# EAGLE design Air858 (EAGLE 7.7.0)
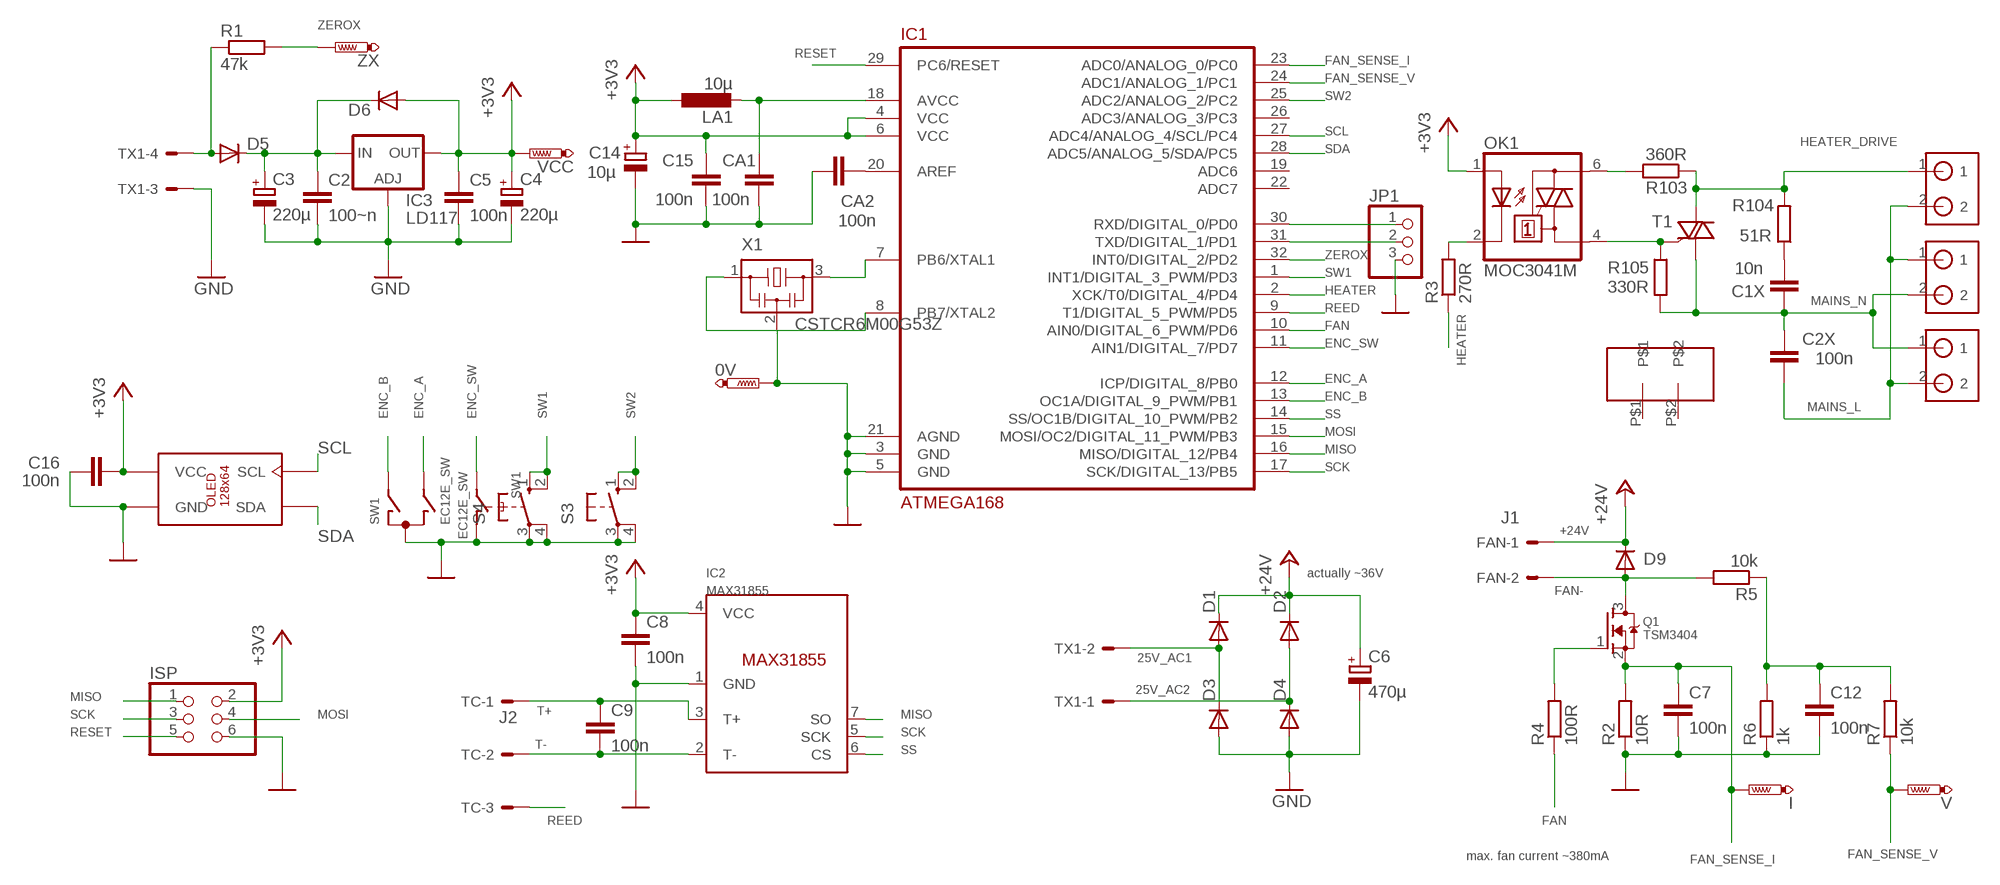
[diagram p0: schematic, sheet 1]

## Parts
0V  PTR1B1,27  [B1,27]
C1X  10n  C-EU075-032X103  [C075-032X103]
C2  100~n  C-EUC0603  [C0603]
C2X  100n  C-EU150-054X183  [C150-054X183]
C3  220µ  CPOL-EUSMCE  [SMC_E]
C4  220µ  CPOL-EUSMCE  [SMC_E]
C5  100n  C-EUC0603  [C0603]
C6  470µ  CPOL-EUE5-10.5  [E5-10,5]
C7  100n  C-EUC0603K  [C0603K]
C8  100n  C-EUC0603K  [C0603K]
C9  100n  C-EUC0603K  [C0603K]
C12  100n  C-EUC0603K  [C0603K]
C14  10µ  CPOL-EUB/3528-21W  [B/3528-21W]
C15  100n  C-EUC0603K  [C0603K]
C16  100n  C-EUC0603K  [C0603K]
CA1  100n  C-EUC0603K  [C0603K]
CA2  100n  C-EUC0603K  [C0603K]
D1  DIODE-DO-214AC  [DO-214AC]
D2  DIODE-DO-214AC  [DO-214AC]
D3  DIODE-DO-214AC  [DO-214AC]
D4  DIODE-DO-214AC  [DO-214AC]
D5  DIODE-DO-214AC  [DO-214AC]
D6  DIODE-DO-214AC  [DO-214AC]
D9  DIODE-DO-214AC  [DO-214AC]
FAN  J1  22-23-2021  [22-23-2021]
HEATER  2POL5MM  [2POL5MM]
I  PTR1B1,27  [B1,27]
IC1  ATMEGA168  AVR-ATMEGA168-TQP32  [QFP32]
IC2  MAX31855  [SOIC8]
IC3  LD117  LD117AS12TR  [SOT223]
ISP  PINHD-2X3  [2X03]
JP1  PINHD-1X3  [1X03]
LA1  10µ  L-EUL3225P  [L3225P]
MAINS1  2POL5MM  [2POL5MM]
MAINS2  2POL5MM  [2POL5MM]
OK1  MOC3041M  [DIL06]
OLED1  SSD1306-IIC  [SSD1306-IIC]
Q1  TSM3404  MOSFET-NREFLOW  [SOT23]
R1  47k  R-EU_R0603  [R0603]
R2  10R  R-EU_M1206  [M1206]
R3  270R  R-EU_R0603  [R0603]
R4  100R  R-EU_R0603  [R0603]
R5  10k  R-EU_R0603  [R0603]
R6  1k  R-EU_R0603  [R0603]
R7  10k  R-EU_R0603  [R0603]
R103  360R  R-EU_M1206  [M1206]
R104  51R  R-EU_0309/10  [0309/10]
R105  330R  R-EU_M1206  [M1206]
S3  40-XX  [B3F-40XX]
S4  40-XX  [B3F-40XX]
SW1  EC12E_SW  [ALPS_EC12E_SW]
T1  BTA16  TIC206D  [TO220BV]
TC  J2  22-23-2031  [22-23-2031]
TX1  J4  22-23-2041  [22-23-2041]
U$5  HEATSINK17X7.5TO220  [HEATSINK17X7.5TO220]
V  PTR1B1,27  [B1,27]
VCC  PTR1B1,27  [B1,27]
X1  CSTCR6M00G53Z  [CSTCR6M]
ZX  PTR1B1,27  [B1,27]

## Nets
10V_AC1: D5.A R1.1 TX1.4
25V_AC1: D1.A D3.C TX1.2
25V_AC2: D2.A D4.C TX1.1
+3V3: C4.+ C5.1 C8.1 C14.+ C15.1 C16.2 D6.A IC1.4(VCC) IC1.6(VCC) IC2.4(VCC) IC3.4(OUT) ISP.2 LA1.1 OK1.1(A) OLED1.VCC VCC.TP
+24V: C6.+ D1.C D2.C D9.C FAN.1
AREF: CA2.2 IC1.20(AREF)
AVCC: CA1.1 IC1.18(AVCC) LA1.2
ENC_A: IC1.12(ICP/DIGITAL_8/PB0) SW1.B
ENC_B: IC1.13(OC1A/DIGITAL_9_PWM/PB1) SW1.A
ENC_SW: IC1.11(AIN1/DIGITAL_7/PD7) SW1.E
FAN: IC1.10(AIN0/DIGITAL_6_PWM/PD6) R4.1
FAN-: D9.A FAN.2 Q1.3(D) R5.2
FAN_SENSE_I: C7.1 I.TP IC1.23(ADC0/ANALOG_0/PC0) Q1.2(S) R2.2
FAN_SENSE_V: IC1.24(ADC1/ANALOG_1/PC1) R7.1 V.TP
GND: 0V.TP C2.2 C3.- C4.- C5.2 C6.- C7.2 C8.2 C12.2 C14.- C15.2 C16.1 CA1.2 CA2.1 D3.A D4.A IC1.3(GND) IC1.5(GND) IC1.21(AGND) IC2.1(GND) IC3.1(ADJ) ISP.6 JP1.3 OLED1.GND R2.1 R6.1 S3.3(P) S3.4(P1) S4.3(P) S4.4(P1) SW1.C SW1.D TX1.3 X1.2
HEATER: IC1.2(XCK/T0/DIGITAL_4/PD4) R3.1
HEATER_DRIVE: HEATER.1 R103.1 R104.2 T1.T2(A2)
MAINS_L: C2X.1 HEATER.2 MAINS1.1 MAINS2.2
MAINS_N: C1X.1 C2X.2 MAINS1.2 MAINS2.1 R105.2 T1.T1(A1)
MISO: IC1.16(MISO/DIGITAL_12/PB4) IC2.7(SO) ISP.1
MOSI: IC1.15(MOSI/OC2/DIGITAL_11_PWM/PB3) ISP.4
N$1: C12.1 R5.1 R6.2 R7.2
N$3: OK1.6(A2) R103.2
N$4: C2.1 C3.+ D5.C D6.C IC3.3(IN)
N$5: OK1.2(C) R3.2
N$8: OK1.4(A1) R105.1 T1.G
N$9: C1X.2 R104.1
N$10: IC1.7(PB6/XTAL1) X1.3
N$11: Q1.1(G) R4.2
N$12: IC1.8(PB7/XTAL2) X1.1
REED: IC1.9(T1/DIGITAL_5_PWM/PD5) TC.3
RESET: IC1.29(PC6/RESET) ISP.5
RXD: IC1.30(RXD/DIGITAL_0/PD0) JP1.1
SCK: IC1.17(SCK/DIGITAL_13/PB5) IC2.5(SCK) ISP.3
SCL: IC1.27(ADC4/ANALOG_4/SCL/PC4) OLED1.SCL
SDA: IC1.28(ADC5/ANALOG_5/SDA/PC5) OLED1.SDA
SS: IC1.14(SS/OC1B/DIGITAL_10_PWM/PB2) IC2.6(CS)
SW1: IC1.1(INT1/DIGITAL_3_PWM/PD3) S4.1(S) S4.2(S1)
SW2: IC1.25(ADC2/ANALOG_2/PC2) S3.1(S) S3.2(S1)
T+: C9.1 IC2.3(T+) TC.1
T-: C9.2 IC2.2(T-) TC.2
TXD: IC1.31(TXD/DIGITAL_1/PD1) JP1.2
ZEROX: IC1.32(INT0/DIGITAL_2/PD2) R1.2 ZX.TP
Unconnected: IC1.19(ADC6) IC1.22(ADC7) IC1.26(ADC3/ANALOG_3/PC3) SW1.GND1(G) SW1.GND2(G) U$5.P$1 U$5.P$2

## Notes on the sheet
- actually ~36V
- max. fan current ~380mA

## Library data of the parts
0V I V VCC ZX = testpad:PTR1: TEST PIN
C1X C2 C2X C5 C7-C9 C12 C15 C16 CA1 CA2 = rcl:C-EU: CAPACITOR, European symbol
C3 C4 C6 C14 = rcl:CPOL-EU: POLARIZED CAPACITOR, European symbol
D1-D6 D9 = diode:DIODE-: DIODE
FAN = con-molex:22-23-2021: .100" (2.54mm) Center Header - 2 Pin; MF: MOLEX; MPN: 22-23-2021; OC_FARNELL: 1462926; OC_NEWARK: 25C3832
HEATER MAINS1 MAINS2 = pit:2POL5MM
IC1 = tidyeagle:AVR-ATMEGA168-TQP32: Atmel 8-bit Microcontroller in TQFP32 package. Datasheet: Summary <http://www.atmel.com/dyn/resources/prod_documents/8271S.pdf>, Full <http://www.atmel.com/dyn/resources/prod_documents/doc8271.pdf> Application Notes: AVR042 - Hardware Design Considerations <http://atmel.com/dyn/resources/prod_documents/doc2521.pdf> Supports the following chips - ATmega48PA ATmega88PA ATmega168PA ATmega328P With Arduino pin labelling.
IC2 = AlexW-Eagle-Libraries:MAX31855
IC3 = v-reg:LD117A?*: Low drop fixed and adjustable positive voltage regulators 1 A Source: http://www.st.com/stonline/products/literature/ds/7194/ld1117axx.pdf
ISP = pinhead:PINHD-2X3: PIN HEADER
JP1 = adafruit:PINHD-1X3: PIN HEADER
LA1 = rcl:L-EU: INDUCTOR, European symbol
OK1 = optocoupler:MOC30*: 6-Pin DIP Zero-Cross Optoisolators Triac Driver Output (250/400 Volt Peak) Source: Data sheet <http://www.fairchildsemi.com/ds/MO/MOC3031M.pdf> The old path of data sheet not more available 2013-05-06.; MF: FAIRCHILD SEMICONDUCTOR; MPN: MOC3041M; OC_FARNELL: 1086677; OC_NEWARK: 78K6090
OLED1 = pit:SSD1306-IIC
Q1 = adafruit:MOSFET-N: N-Channel Mosfet 2N7002E - 60V 260mA SOT23 [Digikey: 2N7002ET1GOSTR-ND] - REEL BSH103 - 30V 850mA SOT23 [Digikey: 568-5013-1-ND]
R1-R7 R103-R105 = rcl:R-EU_: RESISTOR, European symbol
S3 S4 = switch-omron:40-XX: OMRON SWITCH; MF: OMRON COMPONENTS USA; MPN: B3F-4000; OC_FARNELL: 176434; OC_NEWARK: 36K3105
SW1 = switch-alps:EC12E_SW: ALPS rotary Encoder EC12E series with switch; MPN: EC12E2424407; OC_FARNELL: 1520813; OC_NEWARK: 74M1068
T1 = triac:TIC206: TRIAC Source: http://www.bourns.com/pdfs/tic206.pdf
TC = con-molex:22-23-2031: .100" (2.54mm) Center Header - 3 Pin; MF: MOLEX; MPN: 22-23-2031; OC_FARNELL: 1462950; OC_NEWARK: 30C0862
TX1 = con-molex:22-23-2041: .100" (2.54mm) Center Header - 4 Pin; MF: MOLEX; MPN: 22-23-2041; OC_FARNELL: 1462920; OC_NEWARK: 38C0355
U$5 = pit:HEATSINK17X7.5TO220
X1 = murata-filter:CSTCR: Resonator Source: murata.co.jp; MPN: CSTCR6M00G53-R0; OC_FARNELL: 1170434; OC_NEWARK: 25M8759

## Board
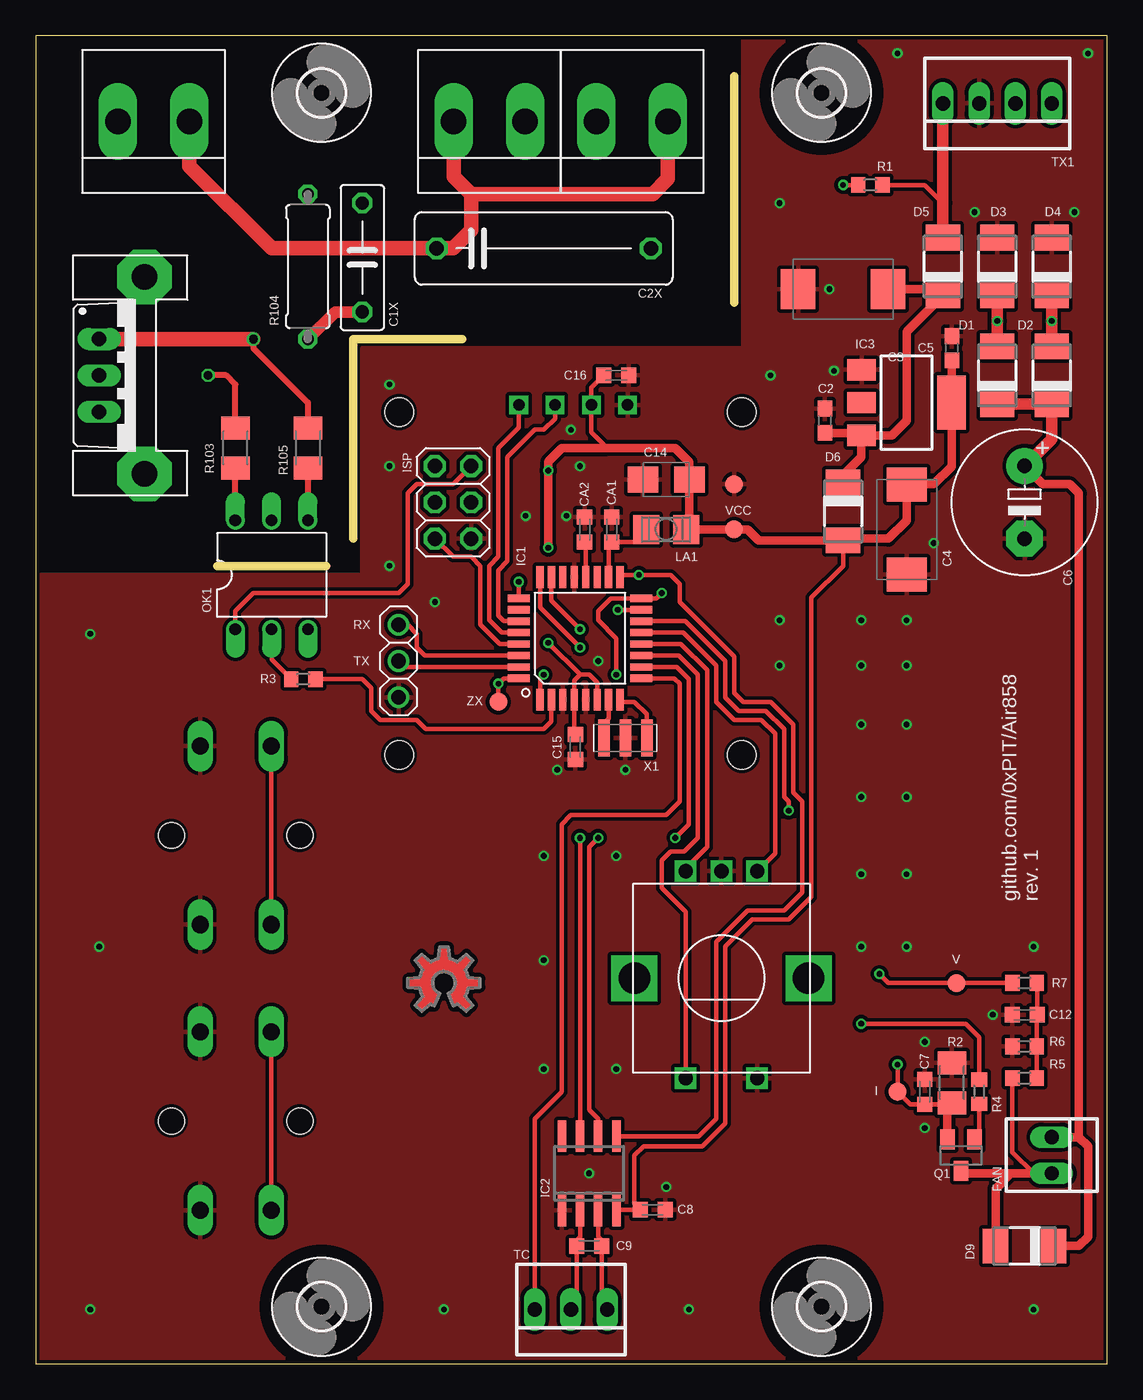
[diagram p1: board, top side]
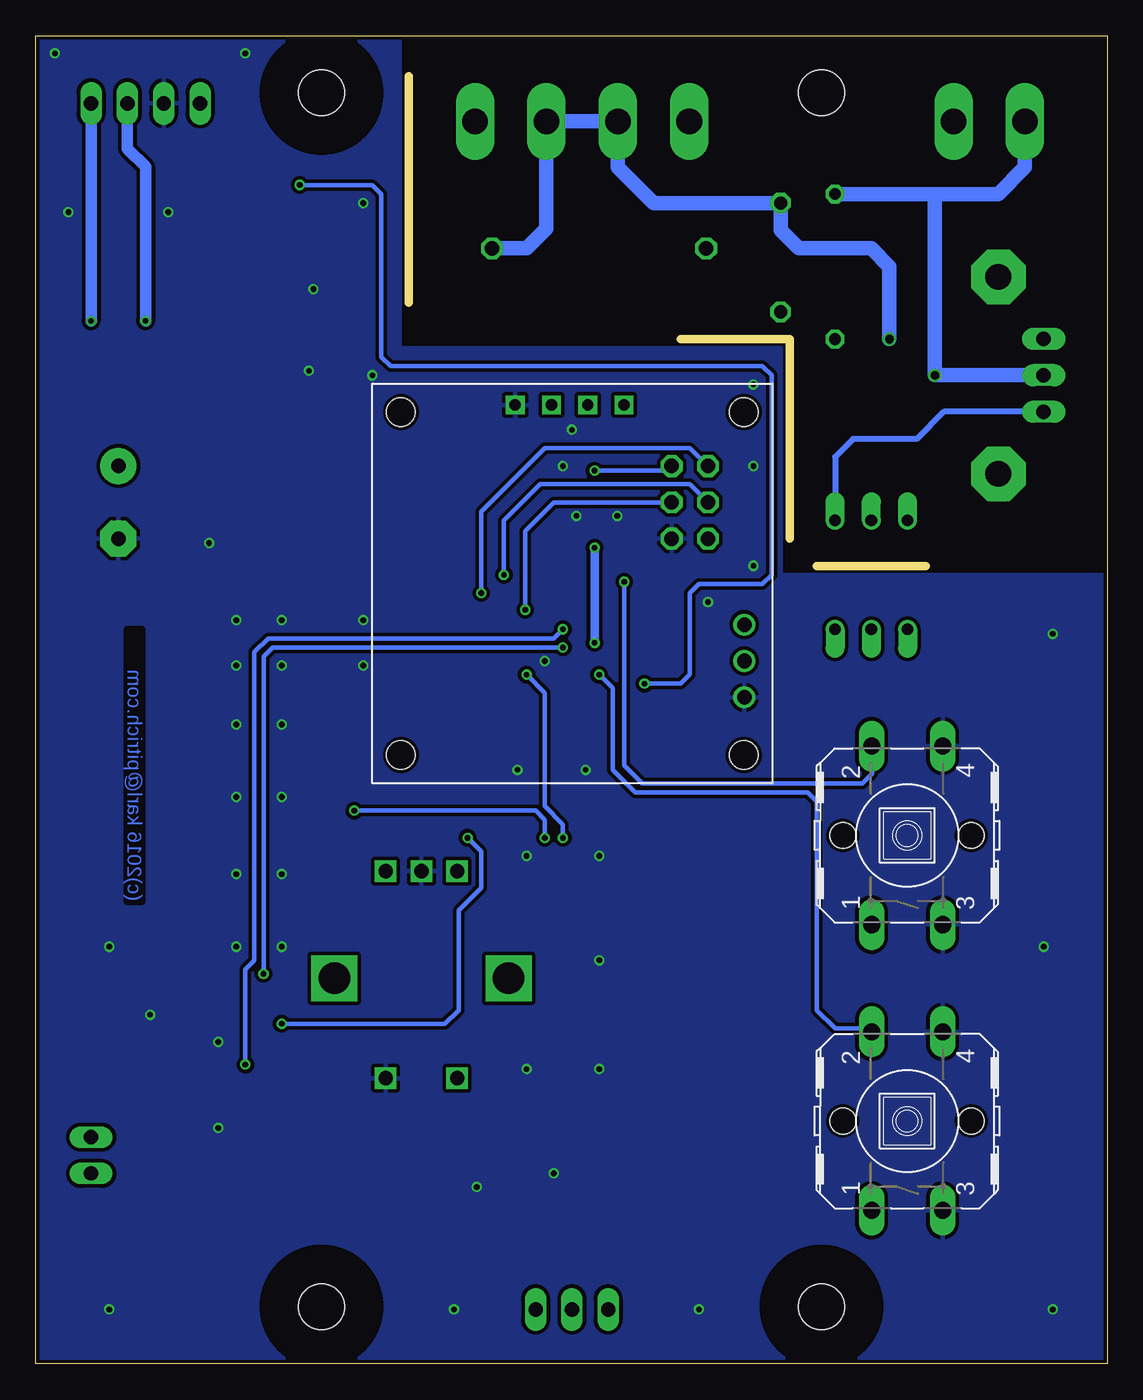
[diagram p2: board, bottom side, seen from below]

Size 75 x 93 mm. Coordinates in mm from the lower left corner, seen from the top.
Outline: 0,0 75,0 75,93 0,93 0,0
Copper layers (1*16): Top 0.035mm / dielectric 1.5mm / Bottom 0.035mm
Design rules "dirt_cheap_dirty_boards.v1": minimum track width 5mil, minimum drill 12mil, track to track 5mil, track to pad 5mil, pad to pad 5mil, via to via 5mil, smd to smd 0mil, copper to edge 10mil, drill to drill 10mil, minimum pad ring 10mil, minimum via ring 6mil, stop-mask expansion 2mil, vias tented up to drill 25mil, thermal gap 10mil
Milling: 4 lines

### Footprints (pad centres in the part's own frame; a part is rotated, then mirrored left to right if it is on the bottom)
B1,27 = smd 1.27 x 1.27: TP 0,0
C075-032X103 = drill 0.914 octagon: 1 -3.81,0; 2 3.81,0
C0603 = smd 1.1 x 1: 1 -0.85,0; 2 0.85,0
C150-054X183 = drill 1.016 octagon: 1 -7.493,0; 2 7.493,0
SMC_E = smd 2.4 x 2.8: + -3.15,0; - 3.15,0
E5-10,5 = drill 1.016 pad 2.54: + -2.54,0 | drill 1.016 pad 2.54 octagon: - 2.54,0
C0603K = smd 1.05 x 1.08: 1 -0.875,0; 2 0.875,0
B/3528-21W = smd 2.15 x 1.8: + 1.625,0; - -1.625,0
DO-214AC = smd 1.8 x 2.4: A 2.025,0; C -2.025,0
22-23-2021 = drill 1 long: 1 -1.27,0; 2 1.27,0
2POL5MM = drill 1.8 long: 1 -2.5,0; 2 2.5,0
QFP32 = smd 0.508 x 1.524: 1 -2.8,-4.293; 2 -2,-4.293; 3 -1.2,-4.293; 4 -0.4,-4.293; 5 0.4,-4.293; 6 1.2,-4.293; 7 2,-4.293; 8 2.8,-4.293; 17 2.8,4.293; 18 2,4.293; 19 1.2,4.293; 20 0.4,4.293; 21 -0.4,4.293; 22 -1.2,4.293; 23 -2,4.293; 24 -2.8,4.293 | smd 1.524 x 0.508: 9 4.293,-2.8; 10 4.293,-2; 11 4.293,-1.2; 12 4.293,-0.4; 13 4.293,0.4; 14 4.293,1.2; 15 4.293,2; 16 4.293,2.8; 25 -4.293,2.8; 26 -4.293,2; 27 -4.293,1.2; 28 -4.293,0.4; 29 -4.293,-0.4; 30 -4.293,-1.2; 31 -4.293,-2; 32 -4.293,-2.8
SOIC8 = smd 0.6 x 2.2: 1 -1.905,-2.6; 2 -0.635,-2.6; 3 0.635,-2.6; 4 1.905,-2.6; 5 1.905,2.6; 6 0.635,2.6; 7 -0.635,2.6; 8 -1.905,2.6
SOT223 = smd 1.5 x 2: 1 -2.3,-3.15; 2 0,-3.15; 3 2.3,-3.15 | smd 3.8 x 2: 4 0,3.15
2X03 = drill 1.016 octagon: 1 -2.54,-1.27; 2 -2.54,1.27; 3 0,-1.27; 4 0,1.27; 5 2.54,-1.27; 6 2.54,1.27
1X03 = drill 1.016: 1 -2.54,0; 2 0,0; 3 2.54,0
L3225P = smd 1.8 x 2: 1 -1.4,0; 2 1.4,0
DIL06 = drill 0.813 offset: 1 -2.54,-3.81; 2 0,-3.81; 3 2.54,-3.81; 4 2.54,3.81; 5 0,3.81; 6 -2.54,3.81
SSD1306-IIC = drill 0.8 square: GND 10,26.5; SCL 15.08,26.5; SDA 17.62,26.5; VCC 12.54,26.5 | hole 2: 2,2; 26,26; 26,2; 2,26
SOT23 = smd 1 x 1.4: 1 -0.95,-1.1; 2 0.95,-1.1; 3 0,1.1
R0603 = smd 1 x 1.1: 1 -0.85,0; 2 0.85,0
M1206 = smd 1.6 x 2: 1 -1.4,0; 2 1.4,0
0309/10 = drill 0.813 octagon: 1 -5.08,0; 2 5.08,0
B3F-40XX = drill 1.194 long: 1 -6.248,2.489; 2 6.248,2.489; 3 -6.248,-2.489; 4 6.248,-2.489 | hole 1.803: 0,-4.496; 0,4.496
ALPS_EC12E_SW = drill 1 square: A -2.5,-7.5; B 2.5,-7.5; C 0,-7.5; D -2.5,7; E 2.5,7 | drill 2.2 square: GND1 -6.1,0; GND2 6.1,0
TO220BV = drill 1.016 long: G 2.54,-2.54; T1 -2.54,-2.54; T2 0,-2.54
22-23-2031 = drill 1 long: 1 -2.54,0; 2 0,0; 3 2.54,0
22-23-2041 = drill 1 long: 1 -3.81,0; 2 -1.27,0; 3 1.27,0; 4 3.81,0
3,2 = hole 3.2: 0,0
HEATSINK17X7.5TO220 = drill 1.8 pad 3.81 octagon: P$1 -6.9,0; P$2 6.9,0
CSTCR6M = smd 0.8 x 2.6: 1 -1.5,0; 2 0,0; 3 1.5,0

### Placement (x,y rotation side)
0V  48.9,61.59 0 top
C1X  22.86,77.47 270 top
C2  55.24,66.04 90 top
C2X  35.56,78.11 0 top
C3  56.52,75.25 180 top
C4  60.96,58.42 270 top
C5  64.14,71.12 90 top
C6  69.22,60.33 270 top
C7  62.23,19.05 90 top
C8  43.18,10.79 0 top
C9  38.73,8.26 180 top
C12  69.22,24.45 180 top
C14  44.13,61.91 0 top
C15  37.78,43.18 270 top
C16  40.64,69.22 180 top
CA1  40.32,58.42 90 top
CA2  38.42,58.42 270 top
D1  67.31,69.22 90 top
D2  71.12,69.22 90 top
D3  67.31,76.83 90 top
D4  71.12,76.83 90 top
D5  63.5,76.83 90 top
D6  56.52,59.69 270 top
D9  69.22,8.26 180 top
FAN  71.12,14.61 270 top
HEATER  8.26,87 0 top
I  60.33,19.05 0 top
IC1  38.1,50.8 0 top
IC2  38.73,13.34 0 top
IC3  60.96,67.31 270 top
ISP  29.21,60.33 270 top
JP1  25.4,49.21 270 top
LA1  44.13,58.42 180 top
MAINS1  31.75,87 0 top
MAINS2  41.75,87 0 top
OK1  16.51,55.24 0 top
OLED1  51.44,40.64 0 bottom
Q1  64.77,14.61 180 top
R1  58.42,82.55 180 top
R2  64.14,19.68 270 top
R3  18.73,47.94 180 top
R4  66.04,19.05 270 top
R5  69.22,20 180 top
R6  69.22,22.23 0 top
R7  69.22,26.67 0 top
R103  13.97,64.14 270 top
R104  19.05,76.83 90 top
R105  19.05,64.14 90 top
S3  14,37 90 bottom
S4  14,17 90 bottom
SW1  48,27 180 top
T1  6.99,69.22 270 top
TC  37.47,3.81 180 top
TX1  67.31,88.27 180 top
U$1  [3,2]  20,89 0 top
U$2  [3,2]  55,89 0 top
U$3  [3,2]  20,4 0 top
U$4  [3,2]  55,4 0 top
U$5  7.62,69.22 90 top
U$6  [OSHWLOGO_TOP_0.2]  28.57,26.67 0 top
V  64.45,26.67 0 top
VCC  48.9,58.42 0 top
X1  41.27,43.81 180 top
ZX  32.38,46.35 0 top

### Tracks (layer width: path | path; a pad name or v marks a point on that pad's centre or on a via)
10V_AC1
  Top 0.305: R1.1 62.23,82.55 63.5,81.28
  Top 0.813: D5.A 63.5,81.28 TX1.4
25V_AC1  (via drill 0.4)
  Top 0.813: D1.A v67.31,73.03 D3.C
  Bottom 0.813: TX1.2 68.58,85.09 67.31,83.82 v67.31,73.03
25V_AC2  (via drill 0.4)
  Top 0.813: D2.A v71.12,73.03 D4.C
  Bottom 0.813: TX1.1 v71.12,73.03
+3V3  (via drill 0.4)
  Top 0.305: C16.2 38.9,68.34 OLED1.VCC 38.9,65.25 40.01,64.14 | ISP.2 29.21,61.59 26.67,61.59 26.04,60.96 26.04,54.61 25.4,53.98 15.24,53.98 13.97,52.7 OK1.1 | C15.1 37.7,44.14 IC1.4 37.7,47.86 38.1,48.26 | IC1.6 39.3,47.7 38.73,48.26 38.1,48.26 | 38.1,48.26 v35.88,50.48 | IC2.4 40.7,10.79 C8.1 41.91,11.19 41.91,14.61 42.55,15.24 46.67,15.24 48.26,16.83 48.26,29.21 50.16,31.11 52.7,31.11 54.29,32.7 54.29,53.66 56.52,55.88 D6.A
  Top 0.61: v35.88,57.15 v35.88,62.55 35.88,63.18 36.83,64.14 40.01,64.14 44.77,64.14 45.76,63.15 C14.+ 45.76,58.65 LA1.1 VCC.TP 49.85,58.42 50.6,57.66 D6.A 56.63,57.78 59.69,57.78 60.96,59.05 C4.+ 60.98,61.59 62.87,61.59 64.11,62.84 IC3.4 64.11,70.25 C5.1
  Bottom 0.305: ISP.2 30.8,62.55 v35.88,62.55
  Bottom 0.61: v35.88,50.48 v35.88,57.15
+24V
  Top 0.61: 73.03,15.88 73.03,60.96 72.39,61.59 70.48,61.59 C6.+ | FAN.1 73.03,15.88 | 73.03,15.88 73.66,15.24 73.66,8.89 73.03,8.26 D9.C
  Top 0.813: D1.C D2.C 71.12,64.77 C6.+
AREF
  Top 0.305: IC1.20 38.5,57.46 CA2.2
AVCC
  Top 0.305: IC1.18 40.1,57.32 CA1.1 42.49,57.55 LA1.2
ENC_A
  Top 0.305: IC1.12 45.17,50.4 46.99,48.58 46.99,36.2 45.5,34.7 SW1.B
ENC_B
  Top 0.305: IC1.13 45.32,51.2 47.62,48.9 47.62,46.35 48.9,45.09 50.8,45.09 51.75,44.13 51.75,35.75 SW1.A
ENC_SW
  Top 0.305: IC1.11 45.02,49.6 46.35,48.26 46.35,36.83 45.4,35.88 44.45,35.88 43.81,35.24 43.81,33.34 45.5,31.65 SW1.E
FAN  (via drill 0.4)
  Top 0.305: IC1.10 44.86,48.8 45.72,47.94 45.72,37.78 v44.77,36.83 | R4.1 66.04,22.86 65.09,23.81 v57.78,23.81
  Bottom 0.305: v44.77,36.83 43.81,35.88 43.81,33.34 45.4,31.75 45.4,24.77 46.35,23.81 v57.78,23.81
FAN-
  Top 0.305: R5.2 68.36,14.82 69.85,13.34
  Top 0.61: FAN.2 69.85,13.34 68.26,13.34 | 68.26,13.34 64.94,13.34 Q1.3 | D9.A 67.19,12.26 68.26,13.34
FAN_SENSE_I  (via drill 0.4)
  Top 0.305: IC1.23 36.1,53.44 v38.1,51.44 | v60.33,20.95 I.TP 61.2,18.18 C7.1 64.05,18.18
  Top 0.61: R2.2 64.05,18.18 63.82,17.95 Q1.2
  Bottom 0.305: v38.1,51.44 38.73,50.8 58.74,50.8 59.69,49.85 59.69,28.26 60.33,27.62 v60.33,20.95
FAN_SENSE_V  (via drill 0.4)
  Top 0.305: IC1.24 35.3,52.97 v38.1,50.16 | v59.05,27.3 59.69,26.67 64.14,26.67 V.TP R7.1
  Bottom 0.305: v38.1,50.16 58.42,50.16 59.05,49.53 v59.05,27.3
GND  (via drill 0.4)
  other vias: 41.27,41.59 36.51,41.59 38.73,13.34 4.45,29.21 52.07,52.07 55.88,69.53 52.07,81.28 52.07,48.9 57.78,48.9 57.78,52.07 60.96,48.9 60.96,44.77 57.78,44.77 40.64,35.56 40.64,20.64 60.96,39.69 60.96,34.29 44.13,12.38 55.56,75.25 65.72,80.64 72.71,80.64 39.37,49.21 62.23,22.54 66.99,24.45 37.15,59.37 38.1,62.87 60.96,52.07 62.23,16.51 45.72,3.81 28.57,3.81 3.81,3.81 69.85,3.81 35.56,20.64 35.56,35.56 35.56,28.26 3.81,51.12 24.77,68.58 24.77,62.87 24.77,55.88 27.94,53.34 60.33,91.76 73.66,91.76 62.87,57.47 69.85,29.21 57.78,39.69 57.78,34.29 57.78,29.21 60.96,29.21 34.29,59.37 37.47,65.41 51.44,69.22
  pour Bottom (isolate 0.254): 0,0 74.93,0 74.93,93.34 49.53,93.34 49.53,71.12 22.86,71.12 22.86,55.24 0,55.24
  pour Top (isolate 0.254): 0,0 74.93,0 74.93,93.34 49.53,93.34 49.53,71.12 22.86,71.12 22.86,55.24 0,55.24
HEATER
  Top 0.305: IC1.2 36.1,44.99 35.56,44.45 27.3,44.45 26.67,45.09 24.13,45.09 23.5,45.72 23.5,47.31 22.86,47.94 R3.1
HEATER_DRIVE  (via drill 0.6)
  Top 0.406: R103.1 13.97,68.58 13.34,69.22 v12.06,69.22
  Bottom 1.016: HEATER.1 5.75,83.78 7.62,81.92 12.06,81.92 | 12.06,81.92 R104.2 | T1.T2 v12.06,69.22 12.06,81.92
MAINS_L
  Top 1.016: MAINS2.2 44.25,82.98 43.18,81.92 30.48,81.92 | 30.48,81.92 30.48,79.38 29.21,78.11 C2X.1 16.51,78.11 10.76,83.86 HEATER.2 | MAINS1.1 29.25,83.14 30.48,81.92
MAINS_N  (via drill 0.6)
  Top 0.406: v15.24,71.75 15.24,71.12 19.05,67.31 R105.2
  Top 1.016: T1.T1 v15.24,71.75
  Bottom 1.016: C2X.2 40.64,78.11 39.25,79.5 MAINS2.1 MAINS1.2 34.25,83.78 31.75,81.28 C1X.1 22.86,79.38 21.59,78.11 16.51,78.11 15.24,76.83 v15.24,71.75
MISO  (via drill 0.4)
  Top 0.305: IC2.7 v38.1,36.83 | v40.64,48.26 40.64,50.8 39.37,52.07 39.37,52.7 40.27,53.6 IC1.16 43.44,53.6 v43.81,53.98
  Bottom 0.305: ISP.1 29.21,64.14 39.37,64.14 43.81,59.69 v43.81,53.98 | v38.1,36.83 38.1,37.78 39.37,39.05 39.37,46.99 v40.64,48.26
MOSI  (via drill 0.4)
  Top 0.305: IC1.15 v40.73,52.8
  Bottom 0.305: v40.73,52.8 40.73,58.33 38.73,60.33 ISP.4
N$1
  Top 0.305: R7.2 70.09,26.64 C12.1 70.06,24.42 R6.2 R5.1
N$3
  Top 0.406: OK1.6 R103.2
N$4
  Top 0.305: 57.63,65.19 IC3.3
  Top 0.61: C2.1 57.63,65.19 | D6.C 56.52,62.23 57.78,63.5 57.78,64.98 IC3.3 59.93,65.01 60.96,66.04 60.96,72.27 D5.C 63.06,75.25 C3.+
N$5
  Top 0.305: R3.2 16.51,49.31 OK1.2
N$8
  Top 0.406: R105.1 OK1.4
  Bottom 0.406: T1.G 11.43,66.67 13.34,64.77 17.78,64.77 19.05,63.5 OK1.4
N$9
  Top 0.813: R104.1 20.95,73.66 C1X.2
N$10
  Top 0.305: X1.3 39.77,44.85 40.1,45.18 IC1.7
N$11
  Top 0.305: Q1.1 66.04,16.02 R4.2
N$12
  Top 0.305: X1.1 42.77,45.49 41.91,46.35 41.05,46.35 IC1.8
REED
  Top 0.305: TC.3 34.92,17.14 36.83,19.05 36.83,37.78 37.47,38.42 44.13,38.42 45.09,39.37 45.09,47.62 44.71,48 IC1.9
RESET
  Top 0.305: IC1.29 32.47,50.4 31.11,51.75 31.11,55.88 30.48,56.52 29.21,56.52 ISP.5
RXD
  Top 0.305: IC1.30 27.23,49.6 26.67,50.16 26.67,51.12 26.04,51.75 JP1.1
SCK  (via drill 0.4)
  Top 0.305: IC1.17 41.05,55.24 v42.23,55.24 44.45,55.24 45.09,54.61 45.09,53.34 48.9,49.53 48.9,46.99 49.53,46.35 51.44,46.35 53.02,44.77 53.02,40.01 53.66,39.37 53.66,33.02 52.39,31.75 49.85,31.75 47.62,29.53 47.62,17.14 46.41,15.94 IC2.5
  Bottom 0.305: ISP.3 29.21,61.59 39.69,61.59 42.23,59.05 v42.23,55.24
SCL
  Top 0.305: IC1.27 32.77,52 32.38,52.39 32.38,55.56 33.02,56.2 33.02,63.5 34.92,65.41 35.56,65.41 36.35,66.2 OLED1.SCL
SDA
  Top 0.305: IC1.28 32.62,51.2 31.75,52.07 31.75,55.88 32.38,56.52 32.38,64.14 33.81,65.56 OLED1.SDA
SS  (via drill 0.4)
  Top 0.305: IC2.6 39.37,17.14 38.73,17.78 38.73,36.2 v39.37,36.83 | IC1.14 45.47,52 48.26,49.21 48.26,46.67 49.21,45.72 51.12,45.72 52.39,44.45 52.39,39.69 52.7,39.37 v52.7,38.73
  Bottom 0.305: v52.7,38.73 40.01,38.73 39.37,38.1 v39.37,36.83
SW1  (via drill 0.4)
  Top 0.305: IC1.1 35.3,48 v35.56,48.26 | S4.2 S4.1
  Bottom 0.305: v35.56,48.26 34.61,47.31 34.61,41.59 33.02,40.01 20.95,40.01 20.32,39.37 20.32,24.77 19.05,23.5 16.74,23.5 S4.2
SW2  (via drill 0.4)
  Top 0.305: S3.2 S3.1 | IC1.25 v33.81,54.76
  Bottom 0.305: S3.2 16.44,41.34 17.14,40.64 32.54,40.64 33.81,41.91 v33.81,54.76
T+
  Top 0.305: IC2.3 39.37,8.89 39.61,8.65 C9.1 39.61,4.21 TC.1
T-
  Top 0.305: IC2.2 38.1,8.89 37.86,8.65 C9.2 37.86,4.21 TC.2
TXD
  Top 0.305: IC1.31 25.81,48.8 JP1.2
ZEROX  (via drill 0.4)
  Top 0.305: R1.2 v56.52,82.55 | IC1.32 32.76,48 v32.38,47.62 ZX.TP
  Bottom 0.305: v56.52,82.55 51.44,82.55 50.8,81.92 50.8,70.48 50.16,69.85 24.13,69.85 23.5,69.22 23.5,55.24 24.13,54.61 28.57,54.61 29.21,53.98 29.21,48.26 29.84,47.62 v32.38,47.62

### Text on the board
Bottom: (c)2016 karl@pitrich.com
tNames: RX | TX | github.com/0xPIT/Air858 / rev. 1